# Altium project SingleChip-Rev2.PrjPcb (part 3 of 8)

## Sheet FPGA-Camera-AWR.SchDoc: =ProjectTitle
size A3; Author: Jaime I. Chait; Organization: NWES LLC; Address1: 111 SW 5th Ave, STE 3150; Address2: Portland, OR 97204; DocumentNumber: SCH-0001; Revision: 2; SheetNumber: 14; SheetTotal: 19
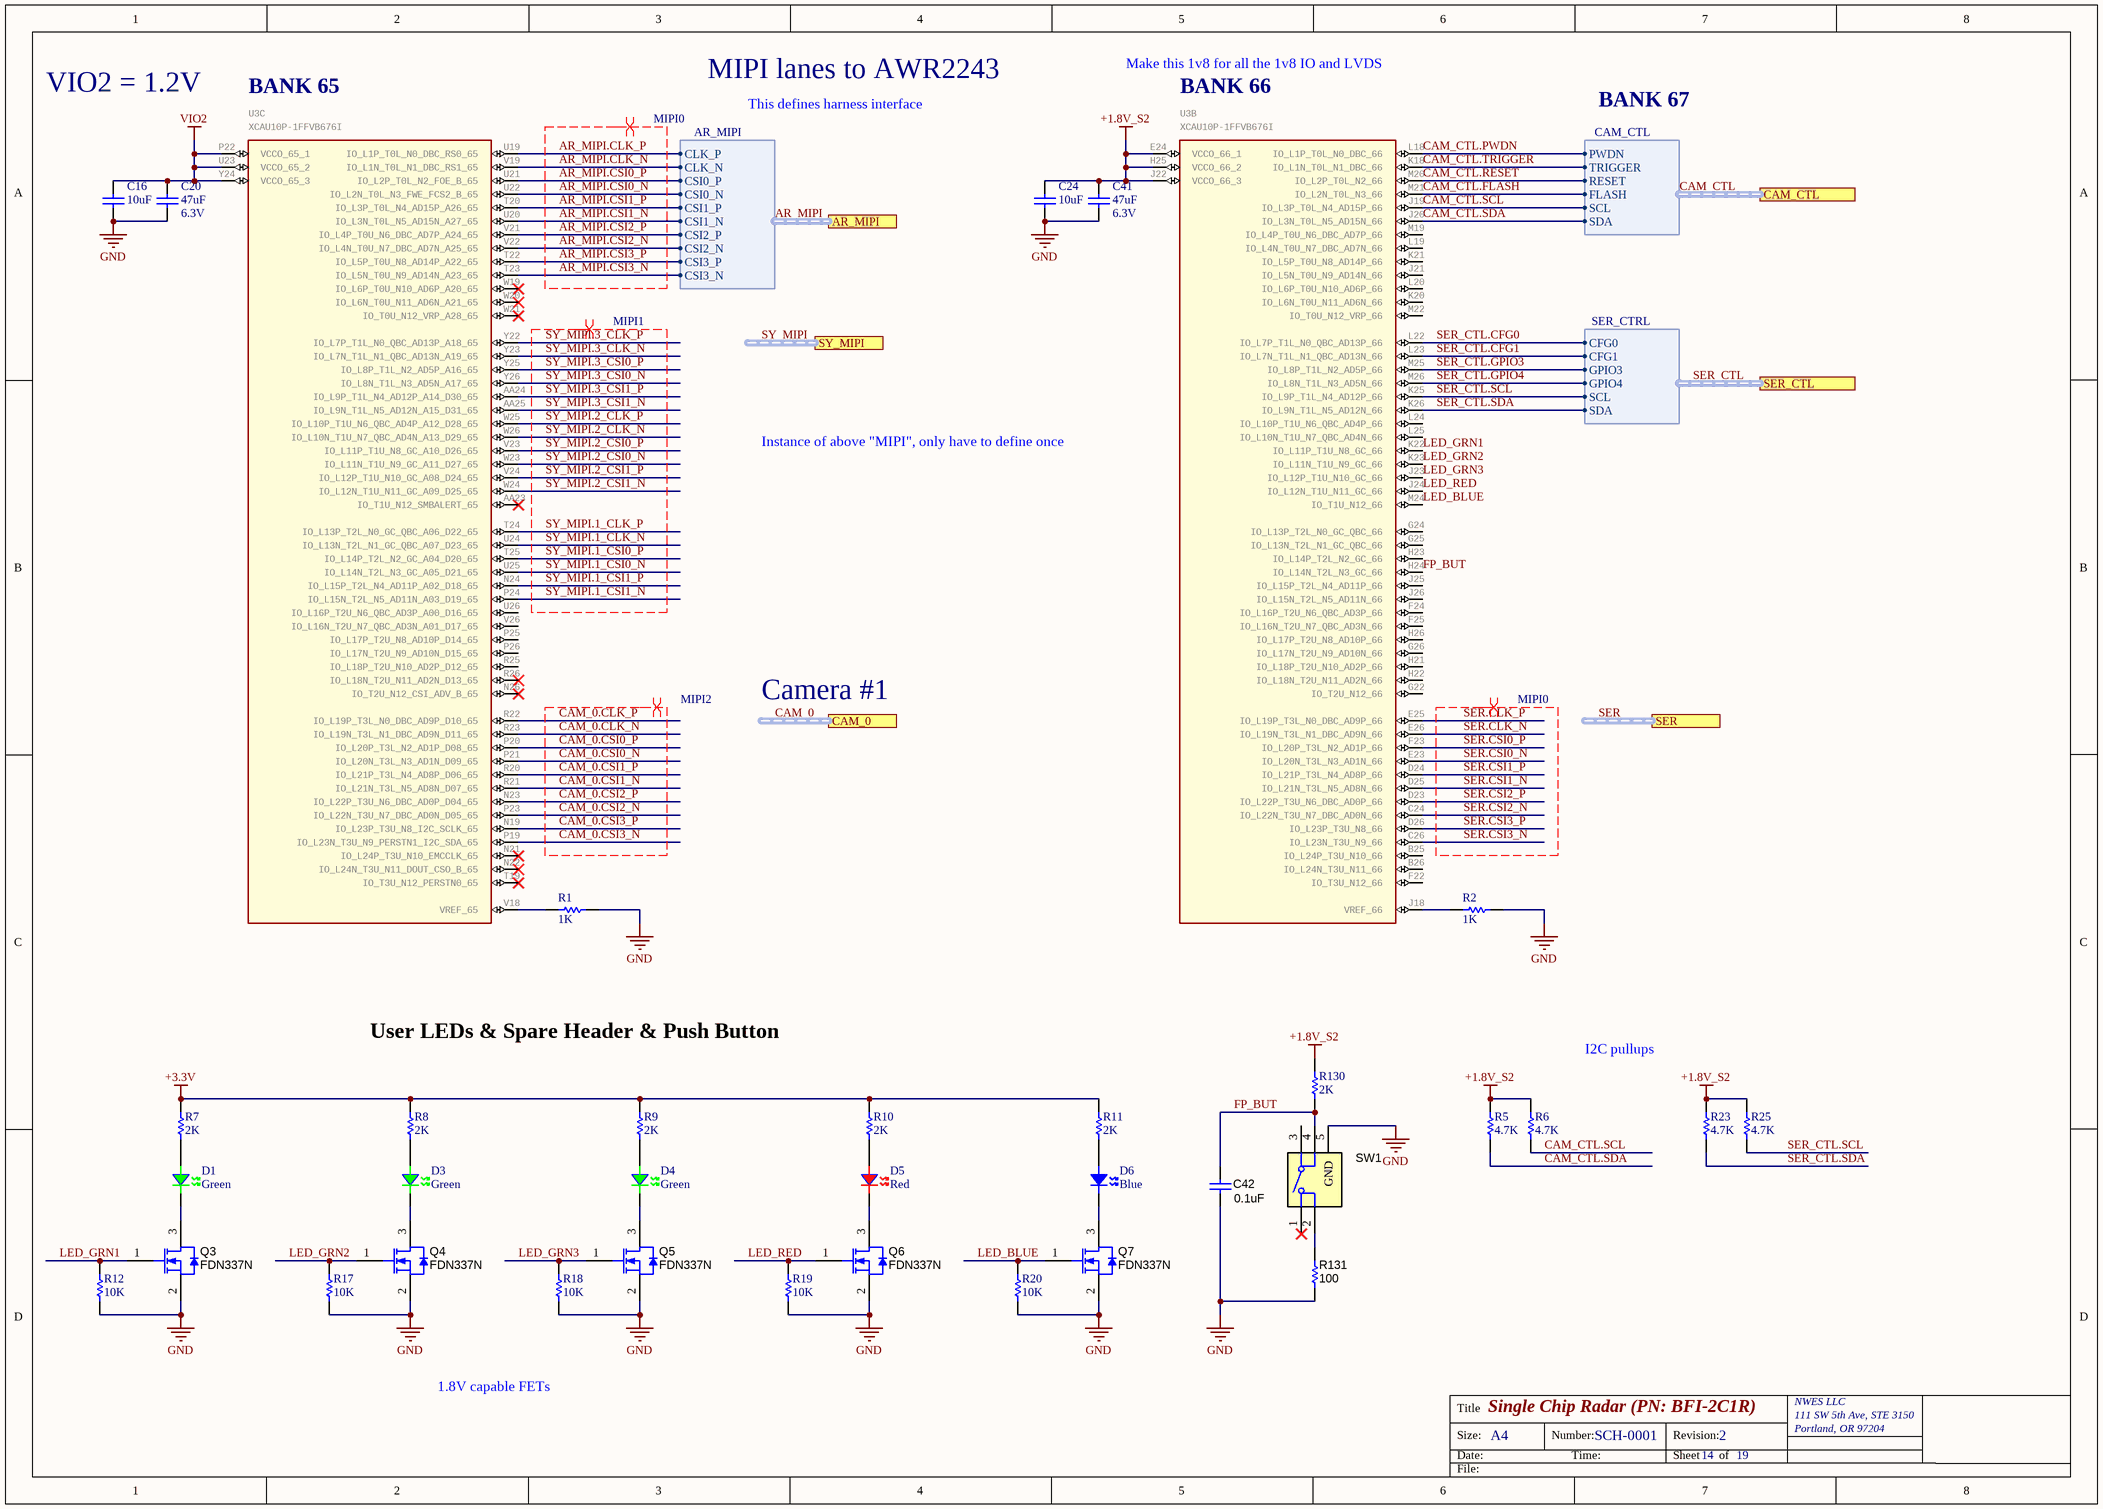
[diagram p8: FPGA-Camera-AWR.SchDoc]

### Parts
C16  10uF  [CAPC1005X90]
C20  47uF  Voltage Rating: 6.3V  [CAPC2012X145USR]
C24  10uF  [CAPC1005X90]
C41  47uF  Voltage Rating: 6.3V  [CAPC2012X145USR]
C42  ValueDisplayed: 0.1uF  [0402L]  (hidden comment: GCM155R71C104KA55D)
D1  Green  [LED_0603]
D3  Green  [LED_0603]
D4  Green  [LED_0603]
D5  Red  [LED_0603]
D6  Blue  [LED_0603]
Q3  FDN337N  [SOT-23]
Q4  FDN337N  [SOT-23]
Q5  FDN337N  [SOT-23]
Q6  FDN337N  [SOT-23]
Q7  FDN337N  [SOT-23]
R1  1K  [RESC1005X40USR]
R2  1K  [RESC1005X40USR]
R5  4.7K  [RESC1005X40USR]
R6  4.7K  [RESC1005X40USR]
R7  2K  [RESC1005X40USR]
R8  2K  [RESC1005X40USR]
R9  2K  [RESC1005X40USR]
R10  2K  [RESC1005X40USR]
R11  2K  [RESC1005X40USR]
R12  10K  [RESC1005X40USR]
R17  10K  [RESC1005X40USR]
R18  10K  [RESC1005X40USR]
R19  10K  [RESC1005X40USR]
R20  10K  [RESC1005X40USR]
R23  4.7K  [RESC1005X40USR]
R25  4.7K  [RESC1005X40USR]
R130  2K  [RESC1005X40USR]
R131  ValueDisplayed: 100  [0402L]  (hidden comment: ERJ-2GEJ101X)
SW1  KMR243GLFG  [SW_KMR243GLFG]  (value not drawn)
U3  XCAU10P-1FFVB676I  [676-FCBGA (27x27)]  (parts B,C of 16)

### Ports
AR_MIPI (harness AR_MIPI), CAM_0 (harness MIPI), CAM_CTL (harness CAM_CTL), SER (harness MIPI), SER_CTL (harness SER_CTRL), SY_MIPI (harness SY_MIPI)

### Harnesses
AR_MIPI: CLK_P, CLK_N, CSI0_P, CSI0_N, CSI1_P, CSI1_N, CSI2_P, CSI2_N, CSI3_P, CSI3_N
CAM_CTL: PWDN, TRIGGER, RESET, FLASH, SCL, SDA
SER_CTRL: CFG0, CFG1, GPIO3, GPIO4, SCL, SDA

### Nets
+1.8V_S2: C24.2 C41.1 R5.2 R6.2 R23.2 R25.2 R130.1 U3.E24(VCCO_66_1) U3.H25(VCCO_66_2) U3.J22(VCCO_66_3)
+3.3V: R7.2 R8.2 R9.2 R10.2 R11.2
GND: C16.1 C20.2 C24.1 C41.2 C42.1 Q3.2(S) Q4.2(S) Q5.2(S) Q6.2(S) Q7.2(S) R1.2 R2.2 R12.1 R17.1 R18.1 R19.1 R20.1 R131.1 SW1.5(GND)
VIO2: C16.2 C20.1 U3.P22(VCCO_65_1) U3.U23(VCCO_65_2) U3.Y24(VCCO_65_3)
AR_MIPI.CLK_N: U3.V19(IO_L1N_T0L_N1_DBC_RS1_65) ; port AR_MIPI.CLK_N
AR_MIPI.CLK_P: U3.U19(IO_L1P_T0L_N0_DBC_RS0_65) ; port AR_MIPI.CLK_P
AR_MIPI.CSI0_N: U3.U22(IO_L2N_T0L_N3_FWE_FCS2_B_65) ; port AR_MIPI.CSI0_N
AR_MIPI.CSI0_P: U3.U21(IO_L2P_T0L_N2_FOE_B_65) ; port AR_MIPI.CSI0_P
AR_MIPI.CSI1_N: U3.U20(IO_L3N_T0L_N5_AD15N_A27_65) ; port AR_MIPI.CSI1_N
AR_MIPI.CSI1_P: U3.T20(IO_L3P_T0L_N4_AD15P_A26_65) ; port AR_MIPI.CSI1_P
AR_MIPI.CSI2_N: U3.V22(IO_L4N_T0U_N7_DBC_AD7N_A25_65) ; port AR_MIPI.CSI2_N
AR_MIPI.CSI2_P: U3.V21(IO_L4P_T0U_N6_DBC_AD7P_A24_65) ; port AR_MIPI.CSI2_P
AR_MIPI.CSI3_N: U3.T23(IO_L5N_T0U_N9_AD14N_A23_65) ; port AR_MIPI.CSI3_N
AR_MIPI.CSI3_P: U3.T22(IO_L5P_T0U_N8_AD14P_A22_65) ; port AR_MIPI.CSI3_P
CAM_0.CLK_N: U3.R23(IO_L19N_T3L_N1_DBC_AD9N_D11_65)
CAM_0.CLK_P: U3.R22(IO_L19P_T3L_N0_DBC_AD9P_D10_65)
CAM_0.CSI0_N: U3.P21(IO_L20N_T3L_N3_AD1N_D09_65)
CAM_0.CSI0_P: U3.P20(IO_L20P_T3L_N2_AD1P_D08_65)
CAM_0.CSI1_N: U3.R21(IO_L21N_T3L_N5_AD8N_D07_65)
CAM_0.CSI1_P: U3.R20(IO_L21P_T3L_N4_AD8P_D06_65)
CAM_0.CSI2_N: U3.P23(IO_L22N_T3U_N7_DBC_AD0N_D05_65)
CAM_0.CSI2_P: U3.N23(IO_L22P_T3U_N6_DBC_AD0P_D04_65)
CAM_0.CSI3_N: U3.P19(IO_L23N_T3U_N9_PERSTN1_I2C_SDA_65)
CAM_0.CSI3_P: U3.N19(IO_L23P_T3U_N8_I2C_SCLK_65)
CAM_CTL.FLASH: U3.M21(IO_L2N_T0L_N3_66) ; port CAM_CTL.FLASH
CAM_CTL.PWDN: U3.L18(IO_L1P_T0L_N0_DBC_66) ; port CAM_CTL.PWDN
CAM_CTL.RESET: U3.M20(IO_L2P_T0L_N2_66) ; port CAM_CTL.RESET
CAM_CTL.SCL: R6.1 U3.J19(IO_L3P_T0L_N4_AD15P_66) ; port CAM_CTL.SCL
CAM_CTL.SDA: R5.1 U3.J20(IO_L3N_T0L_N5_AD15N_66) ; port CAM_CTL.SDA
CAM_CTL.TRIGGER: U3.K18(IO_L1N_T0L_N1_DBC_66) ; port CAM_CTL.TRIGGER
FP_BUT: C42.2 R130.2 SW1.4 U3.H24(IO_L14N_T2L_N3_GC_66)
LED_BLUE: Q7.1(G) R20.2 U3.M24(IO_T1U_N12_66)
LED_GRN1: Q3.1(G) R12.2 U3.K22(IO_L11P_T1U_N8_GC_66)
LED_GRN2: Q4.1(G) R17.2 U3.K23(IO_L11N_T1U_N9_GC_66)
LED_GRN3: Q5.1(G) R18.2 U3.J23(IO_L12P_T1U_N10_GC_66)
LED_RED: Q6.1(G) R19.2 U3.J24(IO_L12N_T1U_N11_GC_66)
SER.CLK_N: U3.E26(IO_L19N_T3L_N1_DBC_AD9N_66)
SER.CLK_P: U3.E25(IO_L19P_T3L_N0_DBC_AD9P_66)
SER.CSI0_N: U3.E23(IO_L20N_T3L_N3_AD1N_66)
SER.CSI0_P: U3.F23(IO_L20P_T3L_N2_AD1P_66)
SER.CSI1_N: U3.D25(IO_L21N_T3L_N5_AD8N_66)
SER.CSI1_P: U3.D24(IO_L21P_T3L_N4_AD8P_66)
SER.CSI2_N: U3.C24(IO_L22N_T3U_N7_DBC_AD0N_66)
SER.CSI2_P: U3.D23(IO_L22P_T3U_N6_DBC_AD0P_66)
SER.CSI3_N: U3.C26(IO_L23N_T3U_N9_66)
SER.CSI3_P: U3.D26(IO_L23P_T3U_N8_66)
SER_CTL.CFG0: U3.L22(IO_L7P_T1L_N0_QBC_AD13P_66) ; port SER_CTL.CFG0
SER_CTL.CFG1: U3.L23(IO_L7N_T1L_N1_QBC_AD13N_66) ; port SER_CTL.CFG1
SER_CTL.GPIO3: U3.M25(IO_L8P_T1L_N2_AD5P_66) ; port SER_CTL.GPIO3
SER_CTL.GPIO4: U3.M26(IO_L8N_T1L_N3_AD5N_66) ; port SER_CTL.GPIO4
SER_CTL.SCL: R25.1 U3.K25(IO_L9P_T1L_N4_AD12P_66) ; port SER_CTL.SCL
SER_CTL.SDA: R23.1 U3.K26(IO_L9N_T1L_N5_AD12N_66) ; port SER_CTL.SDA
SY_MIPI.1_CLK_N: U3.U24(IO_L13N_T2L_N1_GC_QBC_A07_D23_65)
SY_MIPI.1_CLK_P: U3.T24(IO_L13P_T2L_N0_GC_QBC_A06_D22_65)
SY_MIPI.1_CSI0_N: U3.U25(IO_L14N_T2L_N3_GC_A05_D21_65)
SY_MIPI.1_CSI0_P: U3.T25(IO_L14P_T2L_N2_GC_A04_D20_65)
SY_MIPI.1_CSI1_N: U3.P24(IO_L15N_T2L_N5_AD11N_A03_D19_65)
SY_MIPI.1_CSI1_P: U3.N24(IO_L15P_T2L_N4_AD11P_A02_D18_65)
SY_MIPI.2_CLK_N: U3.W26(IO_L10N_T1U_N7_QBC_AD4N_A13_D29_65)
SY_MIPI.2_CLK_P: U3.W25(IO_L10P_T1U_N6_QBC_AD4P_A12_D28_65)
SY_MIPI.2_CSI0_N: U3.W23(IO_L11N_T1U_N9_GC_A11_D27_65)
SY_MIPI.2_CSI0_P: U3.V23(IO_L11P_T1U_N8_GC_A10_D26_65)
SY_MIPI.2_CSI1_N: U3.W24(IO_L12N_T1U_N11_GC_A09_D25_65)
SY_MIPI.2_CSI1_P: U3.V24(IO_L12P_T1U_N10_GC_A08_D24_65)
SY_MIPI.3_CLK_N: U3.Y23(IO_L7N_T1L_N1_QBC_AD13N_A19_65)
SY_MIPI.3_CLK_P: U3.Y22(IO_L7P_T1L_N0_QBC_AD13P_A18_65)
SY_MIPI.3_CSI0_N: U3.Y26(IO_L8N_T1L_N3_AD5N_A17_65)
SY_MIPI.3_CSI0_P: U3.Y25(IO_L8P_T1L_N2_AD5P_A16_65)
SY_MIPI.3_CSI1_N: U3.AA25(IO_L9N_T1L_N5_AD12N_A15_D31_65)
SY_MIPI.3_CSI1_P: U3.AA24(IO_L9P_T1L_N4_AD12P_A14_D30_65)
NetD1_1: D1.1(A) R7.1
NetD1_2: D1.2(K) Q3.3(D)
NetD3_1: D3.1(A) R8.1
NetD3_2: D3.2(K) Q4.3(D)
NetD4_1: D4.1(A) R9.1
NetD4_2: D4.2(K) Q5.3(D)
NetD5_1: D5.1(A) R10.1
NetD5_2: D5.2(K) Q6.3(D)
NetD6_1: D6.1(A) R11.1
NetD6_2: D6.2(K) Q7.3(D)
NetR1_1: R1.1 U3.V18(VREF_65)
NetR2_1: R2.1 U3.J18(VREF_66)
NetR131_2: R131.2 SW1.2

Not connected (* = marked no-connect by the designer): SW1 1* 3; U3 AA23(IO_T1U_N12_SMBALERT_65)* B25(IO_L24P_T3U_N10_66) B26(IO_L24N_T3U_N11_66) F22(IO_T3U_N12_66) F24(IO_L16P_T2U_N6_QBC_AD3P_66) F25(IO_L16N_T2U_N7_QBC_AD3N_66) G22(IO_T2U_N12_66) G24(IO_L13P_T2L_N0_GC_QBC_66) G25(IO_L13N_T2L_N1_GC_QBC_66) G26(IO_L17N_T2U_N9_AD10N_66) H21(IO_L18P_T2U_N10_AD2P_66) H22(IO_L18N_T2U_N11_AD2N_66) H23(IO_L14P_T2L_N2_GC_66) H26(IO_L17P_T2U_N8_AD10P_66) J21(IO_L5N_T0U_N9_AD14N_66) J25(IO_L15P_T2L_N4_AD11P_66) J26(IO_L15N_T2L_N5_AD11N_66) K20(IO_L6N_T0U_N11_AD6N_66) K21(IO_L5P_T0U_N8_AD14P_66) L19(IO_L4N_T0U_N7_DBC_AD7N_66) L20(IO_L6P_T0U_N10_AD6P_66) L24(IO_L10P_T1U_N6_QBC_AD4P_66) L25(IO_L10N_T1U_N7_QBC_AD4N_66) M19(IO_L4P_T0U_N6_DBC_AD7P_66) M22(IO_T0U_N12_VRP_66) N21(IO_L24P_T3U_N10_EMCCLK_65)* N22(IO_L24N_T3U_N11_DOUT_CSO_B_65)* N26(IO_T2U_N12_CSI_ADV_B_65)* P25(IO_L17P_T2U_N8_AD10P_D14_65) P26(IO_L17N_T2U_N9_AD10N_D15_65) R25(IO_L18P_T2U_N10_AD2P_D12_65) R26(IO_L18N_T2U_N11_AD2N_D13_65)* T19(IO_T3U_N12_PERSTN0_65)* U26(IO_L16P_T2U_N6_QBC_AD3P_A00_D16_65) V26(IO_L16N_T2U_N7_QBC_AD3N_A01_D17_65) W19(IO_L6P_T0U_N10_AD6P_A20_65)* W20(IO_L6N_T0U_N11_AD6N_A21_65)* W21(IO_T0U_N12_VRP_A28_65)*

### Buses and harness runs
harness AR_MIPI = port AR_MIPI
harness CAM_0 = port CAM_0
harness CAM_CTL = port CAM_CTL
harness SER = port SER
harness SER_CTL = port SER_CTL
harness SY_MIPI = port SY_MIPI

### Layout directives
differential pair; differential pair class MIPI0: AR_MIPI.CLK_N, AR_MIPI.CLK_P, AR_MIPI.CSI0_N, AR_MIPI.CSI0_P, AR_MIPI.CSI1_N, AR_MIPI.CSI1_P, AR_MIPI.CSI2_N, AR_MIPI.CSI2_P, AR_MIPI.CSI3_N, AR_MIPI.CSI3_P, SER.CLK_N, SER.CLK_P, SER.CSI0_N, SER.CSI0_P, SER.CSI1_N, SER.CSI1_P, SER.CSI2_N, SER.CSI2_P, SER.CSI3_N, SER.CSI3_P
differential pair; differential pair class MIPI1: SY_MIPI.1_CLK_N, SY_MIPI.1_CLK_P, SY_MIPI.1_CSI0_N, SY_MIPI.1_CSI0_P, SY_MIPI.1_CSI1_N, SY_MIPI.1_CSI1_P, SY_MIPI.2_CLK_N, SY_MIPI.2_CLK_P, SY_MIPI.2_CSI0_N, SY_MIPI.2_CSI0_P, SY_MIPI.2_CSI1_N, SY_MIPI.2_CSI1_P, SY_MIPI.3_CLK_N, SY_MIPI.3_CLK_P, SY_MIPI.3_CSI0_N, SY_MIPI.3_CSI0_P, SY_MIPI.3_CSI1_N, SY_MIPI.3_CSI1_P
differential pair; differential pair class MIPI2: CAM_0.CLK_N, CAM_0.CLK_P, CAM_0.CSI0_N, CAM_0.CSI0_P, CAM_0.CSI1_N, CAM_0.CSI1_P, CAM_0.CSI2_N, CAM_0.CSI2_P, CAM_0.CSI3_N, CAM_0.CSI3_P

### Notes on the sheet
- VIO2 = 1.2V
- MIPI lanes to AWR2243
- This defines harness interface
- Make this 1v8 for all the 1v8 IO and LVDS
- BANK 67
- Instance of above "MIPI", only have to define once
- Camera #1
- User LEDs & Spare Header & Push Button
- I2C pullups
- 1.8V capable FETs
- Title
- Size:
- Date:
- A4
- Number:
- Time:
- Revision:
- Sheet
- of
- File:
- (in symbol XCAU10P-1FFVB676I, part B) BANK 66
- (in symbol XCAU10P-1FFVB676I, part C) BANK 65

### Library data of the parts
C16 C24 = CAP CER 10UF 10V X5R 0402: Manufacturer Part Number: CL05A106MP8NUB8; Manufacturer: Samsung Electro-Mechanics; Part #: E-CAP-042; Supplier Part Number 1: 1276-6830-2-ND; Package: 0402; value: 10uF; Supplier 1: Digi-Key; Height: 0.9mm; ComponentLink1Description: New link; ComponentLink1URL: *
C20 C41 = CAP CER 47UF 6.3V X5R 0805: Manufacturer: Samsung; Manufacturer Part Number: CL21A476MQYNNNE; Tolerance: 20%; Supplier 1: Digi-Key; RoHS: Yes; Category: Ceramic Capacitors; Stock 1: 1673694; Pricing 1: 1=0.29000, 10=0.20200, 50=0.13440, 100=0.11420, 500=0.08064, 1000=0.07057 (USD); Mount: Surface Mount; Case/Package: 0805; Case Code (Metric): 2012; Case Code (Imperial): 0805; Contact Plating: Tin; Min Operating Temperature: -55°C; Max Operating Temperature: 85°C; Capacitance: 47uF; Package Quantity: 1; Packaging: Tape and Reel; Dielectric: X5R; Series: CL; Construction: Flat; Length: 2mm; Width: 0.049inch; Height: 1.25mm; Thickness: 0.057inch; Depth: 1.25mm; Radiation Hardening: No; RoHS Compliant: Yes; ComponentLink1URL: https://datasheet.ciiva.com/25791/cl21a476mqynnne-25791153.pdf?src-supplier=Digi-Key; ComponentLink1Description: https://datasheet.ciiva.com/25791/cl21a476mqynnne-25791153.pdf?src-supplier=Digi-Key; ComponentLink2URL: https://datasheet.ciiva.com/26838/getdatasheetpartid-359050-26838632.pdf?src-supplier=Verical; ComponentLink2Description: https://datasheet.ciiva.com/26838/getdatasheetpartid-359050-26838632.pdf?src-supplier=Verical; Supplier Part Number 1: 1276-1852-1-ND
C42 = CMP-0006351-2: CAP, CERM, 0.1 uF, 16 V, +/- 10%, X7R, 0402; Manufacturer: MuRata; TaMin_C: -55°C; Polarized: N; SizeAreaWB_mm2: 3; Value1: Unknown; U/M: EA; Value: 0.1uF; TaMax_C: 125°C; SizeZ_mm: 0.6; SizeX_mm: 1; SizeY_mm: 0.5; Cap_Case: 0402; Value2: 16V; Cap_F: 100nF; AEC Category: Q200; Publisher: Texas Instruments; TempCo: X7R; Published: 2008-06-19; RoHS: Y; MountType: SMT; Supplier 1: Digi-Key; PackageReference: 0402; Tolerance_%: 10%; SizeArea_mm2: 0.5; CompType: Capacitor; LatestRevisionDate: 2017-03-09; PartNumber: GCM155R71C104KA55D; AEC Qualified: ?; VDC_V: 16V; ComponentLink1Description: Datasheet link; Supplier Part Number 1: 490-4759-2-ND; Technology: Ceramic; ComponentLink1URL: http://psearch.murata.com/capacitor/product/GCM155R71C104KA55%23.pdf
D1 D3 D4 = LED GREEN CLEAR SMD 0603: Manufacturer: Vishay Lite-On; Manufacturer Part Number: LTST-C191KGKT; Lens Color: Colorless; Luminous Intensity: 35mcd; Viewing Angle: 130°; Forward Voltage: 2V; Dominant Wavelength: 571nm; Test Current: 20mA; Wavelength: 574nm; Lens Style: Rectangular,Colorless; Forward Current: 30mA; Number of Elements: 1; Power Dissipation: 75mW; Reverse Voltage: 5V; Supplier 1: Digi-Key; RoHS: Yes; Category: Uncategorized; Stock 1: 3115079; Pricing 1: 1=0.26000, 10=0.14100, 100=0.06560, 500=0.06060, 1000=0.04747, 2000=0.04646 (USD); Mount: Surface Mount; Case/Package: 0603; Number of Pins: 2; Color: Green; Case Code (Metric): 1608; Case Code (Imperial): 0603; Min Operating Temperature: -55°C; Max Operating Temperature: 85°C; Packaging: Tape and Reel; Package Quantity: 1; Lens Transparency: Clear; Illumination Color: Green; Number of LEDs: 1; Power Rating: 75mW; Max Power Dissipation: 75mW; Length: 1.6mm; Width: 0.8mm; Height: 0.55mm; Depth: 0.8mm; Radiation Hardening: No; RoHS Compliant: Yes; Lead Free: Lead Free; ComponentLink1URL: https://datasheet.ciiva.com/2109/ltst-c191kgkt-2109973.pdf?src-supplier=Digi-Key; ComponentLink1Description: https://datasheet.ciiva.com/2109/ltst-c191kgkt-2109973.pdf?src-supplier=Digi-Key; Supplier Part Number 1: 160-1446-1-ND
D5 = LED RED CLEAR CHIP SMD 0603: Manufacturer: Vishay Lite-On; Manufacturer Part Number: LTST-C190KRKT; Lens Color: Colorless; Luminous Intensity: 54mcd; Forward Current: 30mA; Viewing Angle: 130°; Forward Voltage: 2.4V; Lens Style: Diffused,Colorless,Clear,Rectangular; Power Rating: 75mW; Dominant Wavelength: 631nm; Test Current: 20mA; Number of Elements: 1; Wavelength: 639nm; Reverse Voltage: 5V; Supplier 1: Digi-Key; RoHS: Yes; Category: LEDs; Stock 1: 1046012; Pricing 1: 1=0.24000, 10=0.13200, 100=0.06110, 500=0.05640, 1000=0.04418, 2000=0.04324 (USD); Mount: Surface Mount; Case/Package: 0603; Number of Pins: 2; Color: Red; Case Code (Metric): 1608; Case Code (Imperial): 0603; Min Operating Temperature: -55°C; Max Operating Temperature: 85°C; Packaging: Tape and Reel; Package Quantity: 1; Illumination Color: Red; Lens Transparency: Clear; Power Dissipation: 75mW; Number of LEDs: 1; Length: 1.6mm; Width: 0.8mm; Height: 0.8mm; Depth: 0.8mm; Radiation Hardening: No; Lead Free: Lead Free; RoHS Compliant: Yes; ComponentLink1URL: https://datasheet.ciiva.com/19482/1260381-19482354.pdf?src-supplier=Jameco; ComponentLink1Description: https://datasheet.ciiva.com/19482/1260381-19482354.pdf?src-supplier=Jameco; ComponentLink2URL: https://datasheet.ciiva.com/11774/0900766b80dc02a9-11774043.pdf?src-supplier=RSComponents; ComponentLink2Description: https://datasheet.ciiva.com/11774/0900766b80dc02a9-11774043.pdf?src-supplier=RSComponents; ComponentLink3URL: https://datasheet.ciiva.com/12403/100-ltst-c190krkt-59805-12403895.pdf?src-supplier=Mouser; ComponentLink3Description: https://datasheet.ciiva.com/12403/100-ltst-c190krkt-59805-12403895.pdf?src-supplier=Mouser; ComponentLink4URL: https://datasheet.ciiva.com/16427/ltst-c190krkt-16427674.pdf?src-supplier=Future+Electronics; ComponentLink4Description: https://datasheet.ciiva.com/16427/ltst-c190krkt-16427674.pdf?src-supplier=Future+Electronics; ComponentLink5URL: https://datasheet.ciiva.com/15117/getdatasheetpartid-57395-15117240.pdf?src-supplier=Verical; ComponentLink5Description: https://datasheet.ciiva.com/15117/getdatasheetpartid-57395-15117240.pdf?src-supplier=Verical; ComponentLink6URL: https://datasheet.ciiva.com/2109/s-110-ltst-c190krkt-2109992.pdf?src-supplier=Digi-Key; ComponentLink6Description: https://datasheet.ciiva.com/2109/s-110-ltst-c190krkt-2109992.pdf?src-supplier=Digi-Key; ComponentLink7URL: https://datasheet.ciiva.com/2109/s-110-ltst-c190krkt-2109991.pdf?src-supplier=Digi-Key; ComponentLink7Description: https://datasheet.ciiva.com/2109/s-110-ltst-c190krkt-2109991.pdf?src-supplier=Digi-Key; ComponentLink8URL: https://datasheet.ciiva.com/2109/s-110-ltst-c190krkt-2109993.pdf?src-supplier=Digi-Key; ComponentLink8Description: https://datasheet.ciiva.com/2109/s-110-ltst-c190krkt-2109993.pdf?src-supplier=Digi-Key; ComponentLink9URL: https://datasheet.ciiva.com/26937/getdatasheetpartid-631582-26937958.pdf?src-supplier=Verical; ComponentLink9Description: https://datasheet.ciiva.com/26937/getdatasheetpartid-631582-26937958.pdf?src-supplier=Verical; Supplier Part Number 1: 160-1436-1-ND
D6 = LED BLUE CLEAR CHIP SMD 0603: LED BLUE CLEAR 0603 SMD; Manufacturer: Vishay Lite-On; Manufacturer Part Number: LTST-C191TBKT; Lens Color: Colorless; Viewing Angle: 130°; Lens Style: Diffused,Colorless,Clear,Rectangular; Forward Voltage: 3.8V; Luminous Intensity: 180mcd; Dominant Wavelength: 475nm; Test Current: 20mA; Number of LEDs: 1; Wavelength: 468nm; Reverse Voltage: 5V; Max Power Dissipation: 75mW; Power Dissipation: 76mW; Supplier 1: Digi-Key; RoHS: Yes; Category: LEDs; Stock 1: 577602; Pricing 1: 1=0.33000, 10=0.26200, 100=0.11780, 500=0.10640, 1000=0.08740, 2000=0.07600 (USD); Mount: Surface Mount; Case/Package: 0603; Number of Pins: 2; Color: Blue; Case Code (Metric): 1608; Case Code (Imperial): 0603; Min Operating Temperature: -20°C; Max Operating Temperature: 80°C; Packaging: Tape and Reel; Package Quantity: 1; Lens Transparency: Clear; Forward Current: 20mA; Illumination Color: Blue; Number of Elements: 1; Length: 0.8mm; Width: 0.8mm; Height: 0.55mm; Depth: 1.6mm; Radiation Hardening: No; RoHS Compliant: Yes; Lead Free: Lead Free; ComponentLink1URL: https://datasheet.ciiva.com/2110/ltst-c191tbkt-2110256.pdf?src-supplier=Digi-Key; ComponentLink1Description: https://datasheet.ciiva.com/2110/ltst-c191tbkt-2110256.pdf?src-supplier=Digi-Key; ComponentLink2URL: https://datasheet.ciiva.com/19465/2047945-19465673.pdf?src-supplier=Jameco; ComponentLink2Description: https://datasheet.ciiva.com/19465/2047945-19465673.pdf?src-supplier=Jameco; ComponentLink3URL: https://datasheet.ciiva.com/11774/0900766b80dc02b4-11774413.pdf?src-supplier=RSComponents; ComponentLink3Description: https://datasheet.ciiva.com/11774/0900766b80dc02b4-11774413.pdf?src-supplier=RSComponents; ComponentLink4URL: https://datasheet.ciiva.com/12400/lite-on-ltst-c191tbkt-187207-12400737.pdf?src-supplier=Mouser; ComponentLink4Description: https://datasheet.ciiva.com/12400/lite-on-ltst-c191tbkt-187207-12400737.pdf?src-supplier=Mouser; ComponentLink5URL: https://datasheet.ciiva.com/16444/ltst-c191tbkt-16444756.pdf?src-supplier=Future+Electronics; ComponentLink5Description: https://datasheet.ciiva.com/16444/ltst-c191tbkt-16444756.pdf?src-supplier=Future+Electronics; ComponentLink6URL: https://datasheet.ciiva.com/15117/getdatasheetpartid-133342-15117680.pdf?src-supplier=Verical; ComponentLink6Description: https://datasheet.ciiva.com/15117/getdatasheetpartid-133342-15117680.pdf?src-supplier=Verical; ComponentLink7URL: https://datasheet.ciiva.com/2110/s-110-ltst-c191tbkt-2110257.pdf?src-supplier=Digi-Key; ComponentLink7Description: https://datasheet.ciiva.com/2110/s-110-ltst-c191tbkt-2110257.pdf?src-supplier=Digi-Key; Supplier Part Number 1: 160-1647-1-ND
Q3-Q7 = MOSFET N-CH 30V 2.2A SUPERSOT3: MOSFET N-CH 30V 2.2A SSOT3; Manufacturer: ON Semiconductor / Fairchild; Drain to Source Resistance: 65mR; Gate to Source Voltage (Vgs): 8V; Power Dissipation: 500mW; Turn-Off Delay Time: 17ns; Element Configuration: Single; Rise Time: 10ns; Turn-On Delay Time: 4ns; Input Capacitance: 300pF; Number of Elements: 1; Threshold Voltage: 700mV; Polarity: N-CHANNEL; Supplier 1: Digi-Key; Manufacturer Part Number: FDN337N; RoHS: Yes; Category: MOSFETs; Stock 1: 48367; Pricing 1: 1=0.49000, 10=0.42000, 100=0.31350, 500=0.24636, 1000=0.19037 (USD); Mount: Surface Mount; Case/Package: TO-236-3; Number of Pins: 3; Contact Plating: Tin,Matte; Weight: 0.03g; Min Operating Temperature: -55°C; Max Operating Temperature: 150°C; Continuous Drain Current (ID): 2.2A; Packaging: Tape and Reel; Drain to Source Breakdown Voltage: 30V; Max Power Dissipation: 500mW; Drain to Source Voltage (Vdss): 30V; Fall Time: 10ns; Package Quantity: 3000; Rds On Max: 65mR; Voltage Rating (DC): 30V; Current Rating: 2.2A; On-State Resistance: 65mR; Series: -; Drain-source On Resistance-Max: 65mR; Dual Supply Voltage: 30V; Termination: SMD/SMT; Nominal Vgs: 700mV; Length: 2.92mm; Width: 3.05mm; Height: 0.94mm; Lead Free: Lead Free; RoHS Compliant: Yes; Reach SVHC Compliant: Yes; ComponentLink1URL: https://datasheet.ciiva.com/14092/fdn337n-eng-datasheet-14092051.pdf?src-supplier=Distrelec; ComponentLink1Description: https://datasheet.ciiva.com/14092/fdn337n-eng-datasheet-14092051.pdf?src-supplier=Distrelec; ComponentLink2URL: https://datasheet.ciiva.com/4442/fdn337n-44286-4442315.pdf?src-supplier=Mouser; ComponentLink2Description: https://datasheet.ciiva.com/4442/fdn337n-44286-4442315.pdf?src-supplier=Mouser; ComponentLink3URL: https://datasheet.ciiva.com/19470/871017-19470804.pdf?src-supplier=Jameco; ComponentLink3Description: https://datasheet.ciiva.com/19470/871017-19470804.pdf?src-supplier=Jameco; ComponentLink4URL: https://datasheet.ciiva.com/6037/fdn337n-6037720.pdf?src-supplier=Farnell; ComponentLink4Description: https://datasheet.ciiva.com/6037/fdn337n-6037720.pdf?src-supplier=Farnell; ComponentLink5URL: https://datasheet.ciiva.com/22681/220571-22681884.pdf?src-supplier=Element14; ComponentLink5Description: https://datasheet.ciiva.com/22681/220571-22681884.pdf?src-supplier=Element14; ComponentLink6URL: https://datasheet.ciiva.com/22655/220571-22655333.pdf?src-supplier=Element14; ComponentLink6Description: https://datasheet.ciiva.com/22655/220571-22655333.pdf?src-supplier=Element14; ComponentLink7URL: https://datasheet.ciiva.com/7968/220571-7968126.pdf?src-supplier=Element14; ComponentLink7Description: https://datasheet.ciiva.com/7968/220571-7968126.pdf?src-supplier=Element14; ComponentLink8URL: https://datasheet.ciiva.com/8115/fdn337n-8115069.pdf?src-supplier=Avnet; ComponentLink8Description: https://datasheet.ciiva.com/8115/fdn337n-8115069.pdf?src-supplier=Avnet; ComponentLink9URL: https://datasheet.ciiva.com/16931/fdn337n-16931214.pdf?src-supplier=Future+Electronics; ComponentLink9Description: https://datasheet.ciiva.com/16931/fdn337n-16931214.pdf?src-supplier=Future+Electronics; ComponentLink10URL: https://datasheet.ciiva.com/8115/fdn337n-8115063.pdf?src-supplier=Avnet; ComponentLink10Description: https://datasheet.ciiva.com/8115/fdn337n-8115063.pdf?src-supplier=Avnet; ComponentLink11URL: https://datasheet.ciiva.com/931/fdn337n-931876.pdf?src-supplier=Digi-Key; ComponentLink11Description: https://datasheet.ciiva.com/931/fdn337n-931876.pdf?src-supplier=Digi-Key; ComponentLink12URL: https://datasheet.ciiva.com/931/fdn337n-931877.pdf?src-supplier=Digi-Key; ComponentLink12Description: https://datasheet.ciiva.com/931/fdn337n-931877.pdf?src-supplier=Digi-Key; ComponentLink13URL: https://datasheet.ciiva.com/931/fdn337n-931875.pdf?src-supplier=Digi-Key; ComponentLink13Description: https://datasheet.ciiva.com/931/fdn337n-931875.pdf?src-supplier=Digi-Key; Supplier Part Number 1: FDN337NCT-ND
R1 R2 = RES 1K OHM 1% 1/16W 0402: Manufacturer: YAGEO; Manufacturer Part Number: RC0402FR-071KL; Supplier Part Number 1: 311-1.00KLRCT-ND; Supplier 1: Digi-Key; Height: 0.4mm; Package: 0402; value: 1K
R5 R6 R23 R25 = RES 4.7K OHM 1% 1/16W 0402: Manufacturer: YAGEO; Manufacturer Part Number: RC0402FR-074K7L; Supplier Part Number 1: 311-4.7KLRCT-ND; Supplier 1: Digi-Key; Height: 0.4mm; Package: 0402; value: 4.7K
R7-R11 R130 = RES 2K OHM 1% 1/16W 0402: Manufacturer: YAGEO; Manufacturer Part Number: RC0402FR-072KL; Supplier Part Number 1: 311-2KLRCT-ND; Supplier 1: Digi-Key; Height: 0.4mm; Package: 0402; value: 2K
R12 R17-R20 = RES 10K OHM 1% 1/16W 0402: Manufacturer: YAGEO; Manufacturer Part Number: RC0402FR-0710KL; Supplier Part Number 1: 311-10.0KLRCT-ND; Package: 0402; Height: 0.4mm; Supplier 1: Digi-Key; value: 10K; Tolerance: ±1%
R131 = CMP-0026993-2: RES, 100, 5%, 0.1 W, AEC-Q200 Grade 0, 0402; Manufacturer: Panasonic; Power_W: 100mW; TempCo: 200 ppm/C; Value_Code: 100R; U/M: EA; Value: 100; EIA_Code: E24; SizeX_mm: 1; SizeY_mm: 0.5; SizeZ_mm: 0.6; Value2: 0.1W; CompType: Resistor; AEC Qualified: Y; AEC Grade: 0; AEC Category: Q200; Supplier Part Number 2: 65T8246; Publisher: Texas Instruments; Supplier 2: Newark; Supplier Part Number 3: 2059210; Supplier 3: Farnell; Published: 2008-06-26; RoHS: Y; Value1: 5%; MountType: SMT; Supplier 1: Digi-Key; PackageReference: 0402; Tolerance_%: 5%; Res_ohm: 100; SizeArea_mm2: 0.5; LatestRevisionDate: 2017-03-09; PartNumber: ERJ-2GEJ101X; ComponentLink1Description: Datasheet link; Supplier Part Number 1: P100JCT-ND; Technology: Thick Film; ComponentLink1URL: https://industrial.panasonic.com/cdbs/www-data/pdf/RDA0000/AOA0000C84.pdf
SW1 = CMP-0002325-1: Switch, SPST-NO, Off-Mom, 0.01 A, 32 VDC, SMD; Manufacturer: C&K Components; CurrentRating_mA: 10A; PositionCount: 1; SizeX_mm: 4.6; SizeY_mm: 2.8; SizeZ_mm: 1.9; SizeArea_mm2: 12.88; VDC_V: 32V; SizeAreaWB_mm2: 21.28; Supplier 2: Mouser; Supplier 1: Digi-Key; Supplier Part Number 1: 401-1432-2-ND; Supplier Part Number 2: 611-KMR243GLFG; PartNumber: KMR243GLFG; ComponentLink1Description: Datasheet URL; LatestRevisionDate: 2017-03-09; ComponentLink1URL: http://www.ckswitches.com/media/1479/kmr2.pdf; CompType: Switch; Publisher: Texas Instruments; Circuit: SPST-NO; RoHS: Y; Orientation: Top Actuated; SwitchFunction: Off-Mom; PackageReference: 4.2x2.8mm; MountType: SMT
U3 = XCAU10P-1FFVB676I: IC FPGA ARTIXUP 676BGA; Manufacturer: AMD Xilinx; Manufacturer Part Number: XCAU10P-1FFVB676I; Supplier Part Number 1: 122-XCAU10P-1FFVB676I-ND; Supplier 1: Supplier

## Sheet FPGA Config_Power.SchDoc: =ProjectTitle
size A3; Author: Jaime I. Chait; Organization: NWES LLC; Address1: 111 SW 5th Ave, STE 3150; Address2: Portland, OR 97204; DocumentNumber: SCH-0001; Revision: 2; SheetNumber: 13; SheetTotal: 19
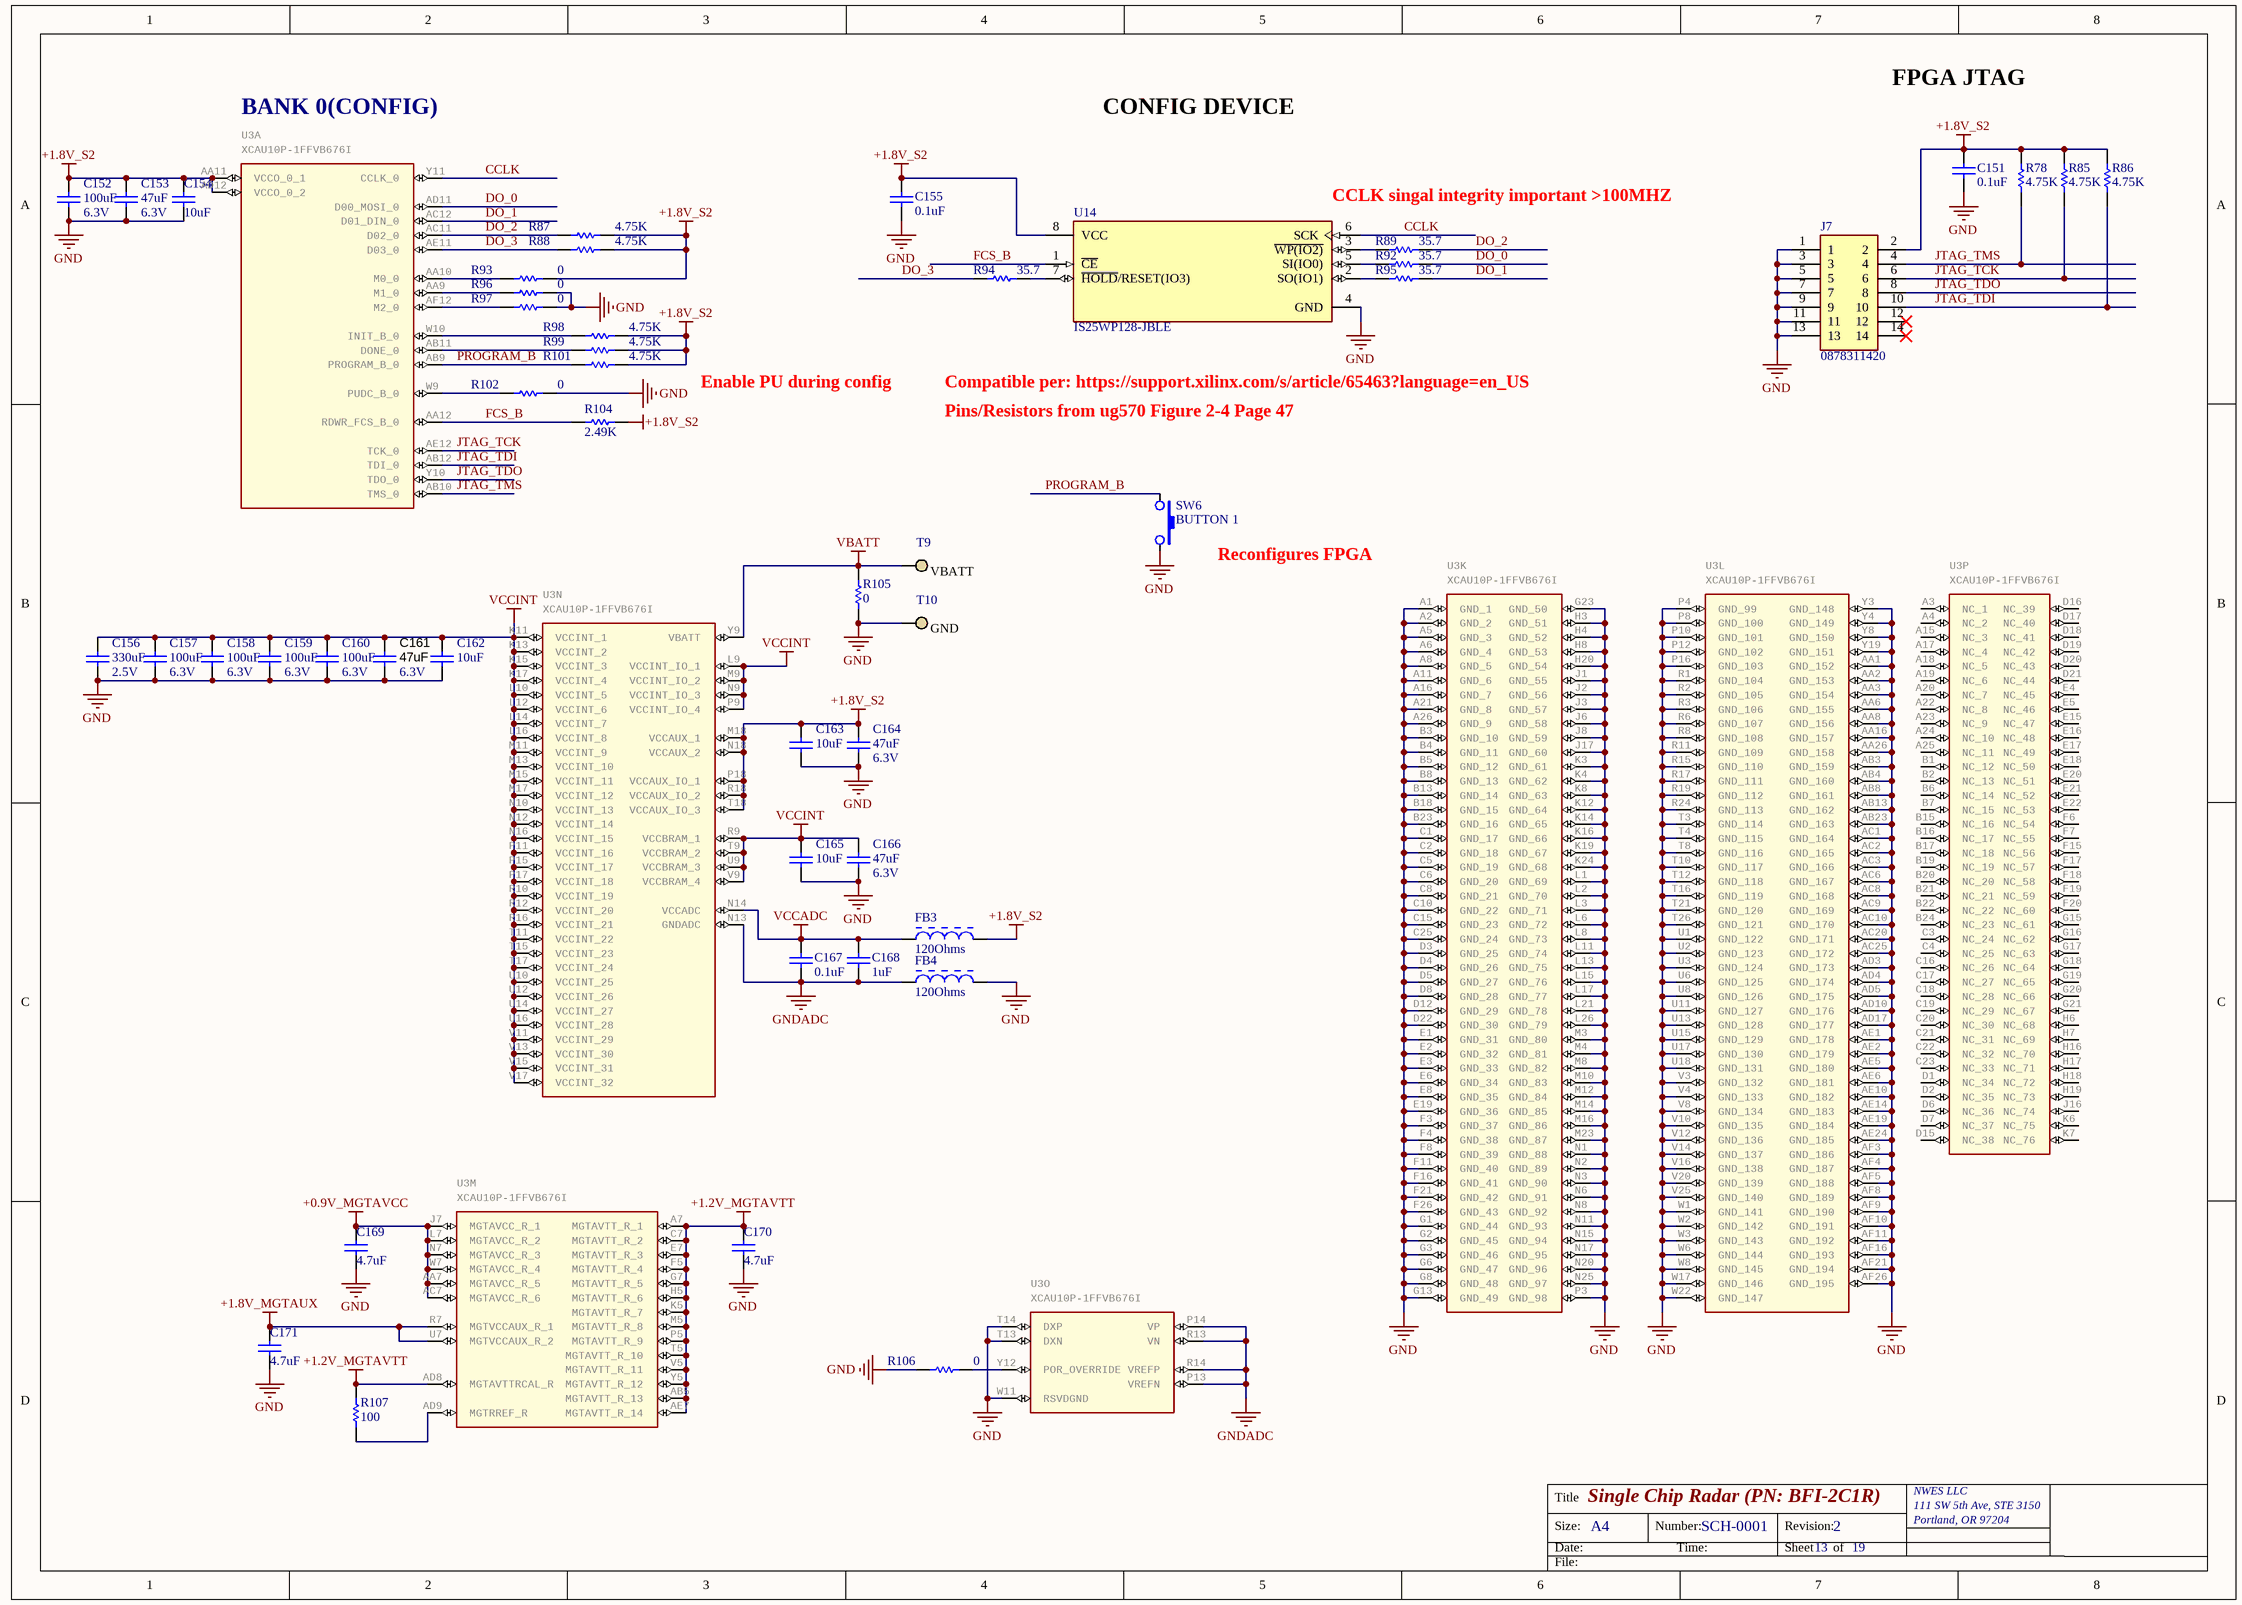
[diagram p9: FPGA Config_Power.SchDoc]

### Parts
C151  0.1uF  [CAPC1005X55USR]
C152  100uF  Voltage Rating: 6.3V  [CAPC2012X145USR]
C153  47uF  Voltage Rating: 6.3V  [CAPC2012X145USR]
C154  10uF  [CAPC1005X90]
C155  0.1uF  [CAPC1005X55USR]
C156  330uF  Voltage Rating: 2.5V  [CAPC3225X280N]
C157  100uF  Voltage Rating: 6.3V  [CAPC2012X145USR]
C158  100uF  Voltage Rating: 6.3V  [CAPC2012X145USR]
C159  100uF  Voltage Rating: 6.3V  [CAPC2012X145USR]
C160  100uF  Voltage Rating: 6.3V  [CAPC2012X145USR]
C161  47uF  Voltage Rating: 6.3V  [CAPC1608X100N]
C162  10uF  [CAPC1005X90]
C163  10uF  [CAPC1005X90]
C164  47uF  Voltage Rating: 6.3V  [CAPC2012X145USR]
C165  10uF  [CAPC1005X90]
C166  47uF  Voltage Rating: 6.3V  [CAPC2012X145USR]
C167  0.1uF  [CAPC1005X55USR]
C168  1uF  [CAPC1005X55USR]
C169  4.7uF  [CAPC1005X65USR]
C170  4.7uF  [CAPC1005X65USR]
C171  4.7uF  [CAPC1005X65USR]
FB3  120Ohms  [0402_FB]
FB4  120Ohms  [0402_FB]
J7  0878311420  [Molex_0878311420]
R78  4.75K  [RESC1005X40USR]
R85  4.75K  [RESC1005X40USR]
R86  4.75K  [RESC1005X40USR]
R87  4.75K  [RESC1005X40USR]
R88  4.75K  [RESC1005X40USR]
R89  35.7  [RESC1005X40USR]
R92  35.7  [RESC1005X40USR]
R93  0  [RESC1005X40USR]
R94  35.7  [RESC1005X40USR]
R95  35.7  [RESC1005X40USR]
R96  0  [RESC1005X40USR]
R97  0  [RESC1005X40USR]
R98  4.75K  [RESC1005X40USR]
R99  4.75K  [RESC1005X40USR]
R101  4.75K  [RESC1005X40USR]
R102  0  [RESC1005X40USR]
R104  2.49K  [RESC1005X40USR]
R105  0  [RESC1005X40USR]
R106  0  [RESC1005X40USR]
R107  100  [RESC1005X40USR]
SW6  BUTTON 1  [PTS820J25MSMTRLFS]
T9  Parameter 1: VBATT  [TP_SM_1MM]  (hidden comment: TP_S)  (no BOM)
T10  Parameter 1: GND  [TP_SM_1MM]  (hidden comment: TP_S)  (no BOM)
U3  XCAU10P-1FFVB676I  [676-FCBGA (27x27)]  (parts A,K,L,M,N,O,P of 16)
U14  IS25WP128-JBLE  [SOIC8_5.3mm_W]

### Nets
+0.9V_MGTAVCC: C169.2 U3.AA7(MGTAVCC_R_5) U3.AC7(MGTAVCC_R_6) U3.J7(MGTAVCC_R_1) U3.L7(MGTAVCC_R_2) U3.N7(MGTAVCC_R_3) U3.W7(MGTAVCC_R_4)
+1.2V_MGTAVTT: C170.2 R107.2 U3.A7(MGTAVTT_R_1) U3.AB5(MGTAVTT_R_13) U3.AD8(MGTAVTTRCAL_R) U3.AE7(MGTAVTT_R_14) U3.C7(MGTAVTT_R_2) U3.E7(MGTAVTT_R_3) U3.F5(MGTAVTT_R_4) U3.G7(MGTAVTT_R_5) U3.H5(MGTAVTT_R_6) U3.K5(MGTAVTT_R_7) U3.M5(MGTAVTT_R_8) U3.P5(MGTAVTT_R_9) U3.T5(MGTAVTT_R_10) U3.V5(MGTAVTT_R_11) U3.Y5(MGTAVTT_R_12)
+1.8V_MGTAUX: C171.2 U3.R7(MGTVCCAUX_R_1) U3.U7(MGTVCCAUX_R_2)
+1.8V_S2: C151.2 C152.1 C153.1 C154.2 C155.2 C163.2 C164.1 FB3.2 J7.2 R78.2 R85.2 R86.2 R87.1 R88.1 R93.2 R98.1 R99.1 R101.1 R104.1 U3.AA11(VCCO_0_1) U3.AD12(VCCO_0_2) U3.M18(VCCAUX_1) U3.N18(VCCAUX_2) U3.P18(VCCAUX_IO_1) U3.R18(VCCAUX_IO_2) U3.T18(VCCAUX_IO_3) U14.8(VCC)
GND: C151.1 C152.2 C153.2 C154.1 C155.1 C156.2 C157.2 C158.2 C159.2 C160.2 C161.2 C162.1 C163.1 C164.2 C165.1 C166.2 C169.1 C170.1 C171.1 FB4.2 J7.1 J7.3 J7.5 J7.7 J7.9 J7.11 J7.13 R96.2 R97.2 R102.2 R105.1 R106.1 SW6.2 T10.1 U3.A1(GND_1) U3.A2(GND_2) U3.A5(GND_3) U3.A6(GND_4) U3.A8(GND_5) U3.A11(GND_6) U3.A16(GND_7) U3.A21(GND_8) U3.A26(GND_9) U3.AA1(GND_152) U3.AA2(GND_153) U3.AA3(GND_154) U3.AA6(GND_155) U3.AA8(GND_156) U3.AA16(GND_157) U3.AA26(GND_158) U3.AB3(GND_159) U3.AB4(GND_160) U3.AB8(GND_161) U3.AB13(GND_162) U3.AB23(GND_163) U3.AC1(GND_164) U3.AC2(GND_165) U3.AC3(GND_166) U3.AC6(GND_167) U3.AC8(GND_168) U3.AC9(GND_169) U3.AC10(GND_170) U3.AC20(GND_171) U3.AC25(GND_172) U3.AD3(GND_173) U3.AD4(GND_174) U3.AD5(GND_175) U3.AD10(GND_176) U3.AD17(GND_177) U3.AE1(GND_178) U3.AE2(GND_179) U3.AE5(GND_180) U3.AE6(GND_181) U3.AE10(GND_182) U3.AE14(GND_183) U3.AE19(GND_184) U3.AE24(GND_185) U3.AF3(GND_186) U3.AF4(GND_187) U3.AF5(GND_188) U3.AF8(GND_189) U3.AF9(GND_190) U3.AF10(GND_191) U3.AF11(GND_192) U3.AF16(GND_193) U3.AF21(GND_194) U3.AF26(GND_195) U3.B3(GND_10) U3.B4(GND_11) U3.B5(GND_12) U3.B8(GND_13) U3.B13(GND_14) U3.B18(GND_15) U3.B23(GND_16) U3.C1(GND_17) U3.C2(GND_18) U3.C5(GND_19) U3.C6(GND_20) U3.C8(GND_21) U3.C10(GND_22) U3.C15(GND_23) U3.C25(GND_24) U3.D3(GND_25) U3.D4(GND_26) U3.D5(GND_27) U3.D8(GND_28) U3.D12(GND_29) U3.D22(GND_30) U3.E1(GND_31) U3.E2(GND_32) U3.E3(GND_33) U3.E6(GND_34) U3.E8(GND_35) U3.E19(GND_36) U3.F3(GND_37) U3.F4(GND_38) U3.F8(GND_39) U3.F11(GND_40) U3.F16(GND_41) U3.F21(GND_42) U3.F26(GND_43) U3.G1(GND_44) U3.G2(GND_45) U3.G3(GND_46) U3.G6(GND_47) U3.G8(GND_48) U3.G13(GND_49) U3.G23(GND_50) U3.H3(GND_51) U3.H4(GND_52) U3.H8(GND_53) U3.H20(GND_54) U3.J1(GND_55) U3.J2(GND_56) U3.J3(GND_57) U3.J6(GND_58) U3.J8(GND_59) U3.J17(GND_60) U3.K3(GND_61) U3.K4(GND_62) U3.K8(GND_63) U3.K12(GND_64) U3.K14(GND_65) U3.K16(GND_66) U3.K19(GND_67) U3.K24(GND_68) U3.L1(GND_69) U3.L2(GND_70) U3.L3(GND_71) U3.L6(GND_72) U3.L8(GND_73) U3.L11(GND_74) U3.L13(GND_75) U3.L15(GND_76) U3.L17(GND_77) U3.L21(GND_78) U3.L26(GND_79) U3.M3(GND_80) U3.M4(GND_81) U3.M8(GND_82) U3.M10(GND_83) U3.M12(GND_84) U3.M14(GND_85) U3.M16(GND_86) U3.M23(GND_87) U3.N1(GND_88) U3.N2(GND_89) U3.N3(GND_90) U3.N6(GND_91) U3.N8(GND_92) U3.N11(GND_93) U3.N15(GND_94) U3.N17(GND_95) U3.N20(GND_96) U3.N25(GND_97) U3.P3(GND_98) U3.P4(GND_99) U3.P8(GND_100) U3.P10(GND_101) U3.P12(GND_102) U3.P16(GND_103) U3.R1(GND_104) U3.R2(GND_105) U3.R3(GND_106) U3.R6(GND_107) U3.R8(GND_108) U3.R11(GND_109) U3.R15(GND_110) U3.R17(GND_111) U3.R19(GND_112) U3.R24(GND_113) U3.T3(GND_114) U3.T4(GND_115) U3.T8(GND_116) U3.T10(GND_117) U3.T12(GND_118) U3.T13(DXN) U3.T14(DXP) U3.T16(GND_119) U3.T21(GND_120) U3.T26(GND_121) U3.U1(GND_122) U3.U2(GND_123) U3.U3(GND_124) U3.U6(GND_125) U3.U8(GND_126) U3.U11(GND_127) U3.U13(GND_128) U3.U15(GND_129) U3.U17(GND_130) U3.U18(GND_131) U3.V3(GND_132) U3.V4(GND_133) U3.V8(GND_134) U3.V10(GND_135) U3.V12(GND_136) U3.V14(GND_137) U3.V16(GND_138) U3.V20(GND_139) U3.V25(GND_140) U3.W1(GND_141) U3.W2(GND_142) U3.W3(GND_143) U3.W6(GND_144) U3.W8(GND_145) U3.W11(RSVDGND) U3.W17(GND_146) U3.W22(GND_147) U3.Y3(GND_148) U3.Y4(GND_149) U3.Y8(GND_150) U3.Y19(GND_151) U14.4(GND)
GNDADC: C167.1 C168.1 FB4.1 U3.N13(GNDADC) U3.P13(VREFN) U3.P14(VP) U3.R13(VN) U3.R14(VREFP)
VBATT: R105.2 T9.1 U3.Y9(VBATT)
VCCADC: C167.2 C168.2 FB3.1 U3.N14(VCCADC)
VCCINT: C156.1 C157.1 C158.1 C159.1 C160.1 C161.1 C162.2 C165.2 C166.1 U3.K11(VCCINT_1) U3.K13(VCCINT_2) U3.K15(VCCINT_3) U3.K17(VCCINT_4) U3.L9(VCCINT_IO_1) U3.L10(VCCINT_5) U3.L12(VCCINT_6) U3.L14(VCCINT_7) U3.L16(VCCINT_8) U3.M9(VCCINT_IO_2) U3.M11(VCCINT_9) U3.M13(VCCINT_10) U3.M15(VCCINT_11) U3.M17(VCCINT_12) U3.N9(VCCINT_IO_3) U3.N10(VCCINT_13) U3.N12(VCCINT_14) U3.N16(VCCINT_15) U3.P9(VCCINT_IO_4) U3.P11(VCCINT_16) U3.P15(VCCINT_17) U3.P17(VCCINT_18) U3.R9(VCCBRAM_1) U3.R10(VCCINT_19) U3.R12(VCCINT_20) U3.R16(VCCINT_21) U3.T9(VCCBRAM_2) U3.T11(VCCINT_22) U3.T15(VCCINT_23) U3.T17(VCCINT_24) U3.U9(VCCBRAM_3) U3.U10(VCCINT_25) U3.U12(VCCINT_26) U3.U14(VCCINT_27) U3.U16(VCCINT_28) U3.V9(VCCBRAM_4) U3.V11(VCCINT_29) U3.V13(VCCINT_30) U3.V15(VCCINT_31) U3.V17(VCCINT_32)
CCLK: U3.Y11(CCLK_0) U14.6(SCK)
DO_0: R92.1 U3.AD11(D00_MOSI_0)
DO_1: R95.1 U3.AC12(D01_DIN_0)
DO_2: R87.2 R89.1 U3.AC11(D02_0)
DO_3: R88.2 R94.2 U3.AE11(D03_0)
FCS_B: R104.2 U3.AA12(RDWR_FCS_B_0) U14.1(~{CE})
JTAG_TCK: J7.6 R85.1 U3.AE12(TCK_0)
JTAG_TDI: J7.10 R86.1 U3.AB12(TDI_0)
JTAG_TDO: J7.8 U3.Y10(TDO_0)
JTAG_TMS: J7.4 R78.1 U3.AB10(TMS_0)
PROGRAM_B: R101.2 SW6.1 U3.AB9(PROGRAM_B_0)
NetR89_2: R89.2 U14.3(~{WP(IO2)})
NetR92_2: R92.2 U14.5(SI(IO0))
NetR93_1: R93.1 U3.AA10(M0_0)
NetR94_1: R94.1 U14.7(~{HOLD}/RESET(IO3))
NetR95_2: R95.2 U14.2(SO(IO1))
NetR96_1: R96.1 U3.AA9(M1_0)
NetR97_1: R97.1 U3.AF12(M2_0)
NetR98_2: R98.2 U3.W10(INIT_B_0)
NetR99_2: R99.2 U3.AB11(DONE_0)
NetR102_1: R102.1 U3.W9(PUDC_B_0)
NetR106_2: R106.2 U3.Y12(POR_OVERRIDE)
NetR107_1: R107.1 U3.AD9(MGTRREF_R)

Not connected (* = marked no-connect by the designer): J7 12* 14*; U3 A3(NC_1) A4(NC_2) A15(NC_3) A17(NC_4) A18(NC_5) A19(NC_6) A20(NC_7) A22(NC_8) A23(NC_9) A24(NC_10) A25(NC_11) B1(NC_12) B2(NC_13) B6(NC_14) B7(NC_15) B15(NC_16) B16(NC_17) B17(NC_18) B19(NC_19) B20(NC_20) B21(NC_21) B22(NC_22) B24(NC_23) C3(NC_24) C4(NC_25) C16(NC_26) C17(NC_27) C18(NC_28) C19(NC_29) C20(NC_30) C21(NC_31) C22(NC_32) C23(NC_33) D1(NC_34) D2(NC_35) D6(NC_36) D7(NC_37) D15(NC_38) D16(NC_39) D17(NC_40) D18(NC_41) D19(NC_42) D20(NC_43) D21(NC_44) E4(NC_45) E5(NC_46) E15(NC_47) E16(NC_48) E17(NC_49) E18(NC_50) E20(NC_51) E21(NC_52) E22(NC_53) F6(NC_54) F7(NC_55) F15(NC_56) F17(NC_57) F18(NC_58) F19(NC_59) F20(NC_60) G15(NC_61) G16(NC_62) G17(NC_63) G18(NC_64) G19(NC_65) G20(NC_66) G21(NC_67) H6(NC_68) H7(NC_69) H16(NC_70) H17(NC_71) H18(NC_72) H19(NC_73) J16(NC_74) K6(NC_75) K7(NC_76)

### Notes on the sheet
- CONFIG DEVICE
- FPGA JTAG
- CCLK singal integrity important >100MHZ
- Enable PU during config
- Compatible per: https://support.xilinx.com/s/article/65463?language=en_US
- Pins/Resistors from ug570 Figure 2-4 Page 47
- Reconfigures FPGA
- Title
- Size:
- Date:
- A4
- Number:
- Time:
- Revision:
- Sheet
- of
- File:
- (in symbol XCAU10P-1FFVB676I, part A) BANK 0(CONFIG)

### Library data of the parts
C151 C155 C167 = CAP CER 0.1UF 25V X5R 0402: Manufacturer Part Number: CL05A104KA5NNNC; Manufacturer: Samsung Electro-Mechanics; Supplier Part Number 1: 1276-1043-1-ND; Package: 0402; Height: 0.55mm; Supplier 1: Digi-Key; value: 0.1uF
C152 C157-C160 = CAP CER 100UF 6.3V X5R 0805: 0805 100 uF 6.3 V ±20% Tolerance X5R Multilayer Ceramic Chip Capacitor; Manufacturer: Murata; Manufacturer Part Number: GRM21BR60J107ME15L; Supplier 1: Digi-Key; RoHS: Yes; Category: Ceramic Capacitors; Stock 1: 780070; Pricing 1: 3000=0.42426, 6000=0.40911, 9000=0.39395, 15000=0.38638 (USD); Mount: Surface Mount; Case/Package: 0805; Case Code (Metric): 2012; Case Code (Imperial): 0805; Min Operating Temperature: -55°C; Max Operating Temperature: 85°C; Packaging: Cut Tape; Dielectric: X5R; Tolerance: 20%; Voltage Rating (DC): 6.3V; Capacitance: 100uF; Series: GRM; Length: 0.079inch; Width: 0.049inch; Thickness: 0.057inch; Reach SVHC Compliant: Yes; Lead Free: Lead Free; RoHS Compliant: Yes; ComponentLink1URL: http://www.farnell.com/datasheets/1957830.pdf?src-supplier=Farnell; ComponentLink1Description: http://www.farnell.com/datasheets/1957830.pdf?src-supplier=Farnell; ComponentLink2URL: http://www.farnell.com/datasheets/1957830.pdf?src-supplier=Element14; ComponentLink2Description: http://www.farnell.com/datasheets/1957830.pdf?src-supplier=Element14; ComponentLink3URL: https://search.murata.co.jp/Ceramy/image/img/A01X/G101/ENG/GRM21BR60J107ME15-01.pdf?src-supplier=Digi-Key; ComponentLink3Description: https://search.murata.co.jp/Ceramy/image/img/A01X/G101/ENG/GRM21BR60J107ME15-01.pdf?src-supplier=Digi-Key; ComponentLink4URL: http://www.farnell.com/datasheets/1957830.pdf?src-supplier=Newark; ComponentLink4Description: http://www.farnell.com/datasheets/1957830.pdf?src-supplier=Newark; Supplier Part Number 1: 490-13981-2-ND
C153 C164 C166 = CAP CER 47UF 6.3V X5R 0805: as C20 on sheet FPGA-Camera-AWR; Supplier 1: Digi-Key; RoHS: Yes; Category: Ceramic Capacitors; Stock 1: 1673694; Pricing 1: 1=0.29000, 10=0.20200, 50=0.13440, 100=0.11420, 500=0.08064, 1000=0.07057 (USD); Mount: Surface Mount; Case/Package: 0805; Case Code (Metric): 2012; Case Code (Imperial): 0805; Contact Plating: Tin; Min Operating Temperature: -55°C; Max Operating Temperature: 85°C; Capacitance: 47uF; Package Quantity: 1; Packaging: Tape and Reel; Dielectric: X5R; Series: CL; Construction: Flat; Length: 2mm; Width: 0.049inch; Height: 1.25mm; Thickness: 0.057inch; Depth: 1.25mm; Radiation Hardening: No; RoHS Compliant: Yes; ComponentLink1URL: https://datasheet.ciiva.com/25791/cl21a476mqynnne-25791153.pdf?src-supplier=Digi-Key; ComponentLink1Description: https://datasheet.ciiva.com/25791/cl21a476mqynnne-25791153.pdf?src-supplier=Digi-Key; ComponentLink2URL: https://datasheet.ciiva.com/26838/getdatasheetpartid-359050-26838632.pdf?src-supplier=Verical; ComponentLink2Description: https://datasheet.ciiva.com/26838/getdatasheetpartid-359050-26838632.pdf?src-supplier=Verical; Supplier Part Number 1: 1276-1852-1-ND
C154 C162 C163 C165 = CAP CER 10UF 10V X5R 0402: as C16 on sheet FPGA-Camera-AWR; Supplier Part Number 1: 1276-6830-2-ND; Package: 0402; value: 10uF; Supplier 1: Digi-Key; Height: 0.9mm; ComponentLink1Description: New link; ComponentLink1URL: *
C156 = CAP CER 330UF 2.5V X6S 1210: 1210 2.5V X6S 330uF 20% multilayer ceramic capacitor; Manufacturer: Murata; Manufacturer Part Number: GRM32EC80E337ME05L; Supplier 1: Digi-Key; RoHS: Yes; Category: Ceramic Capacitors; Stock 1: 66804; Pricing 1: 1=1.88000, 10=1.48300, 50=1.28540, 100=1.11240, 500=0.84050 (USD); Mount: Surface Mount; Case/Package: 1210; Case Code (Metric): 3225; Case Code (Imperial): 1210; Min Operating Temperature: -55°C; Max Operating Temperature: 105°C; Packaging: Tape and Reel; Capacitance: 330uF; Tolerance: 20%; Voltage Rating (DC): 2.5V; Dielectric: X6S; Length: 0.126inch; Width: 0.098inch; Thickness: 0.11inch; RoHS Compliant: Yes; ComponentLink1URL: http://www.farnell.com/datasheets/2867880.pdf?src-supplier=Farnell; ComponentLink1Description: http://www.farnell.com/datasheets/2867880.pdf?src-supplier=Farnell; ComponentLink2URL: http://search.murata.co.jp/Ceramy/image/img/A01X/partnumbering_e_01.pdf?src-supplier=Digi-Key; ComponentLink2Description: http://search.murata.co.jp/Ceramy/image/img/A01X/partnumbering_e_01.pdf?src-supplier=Digi-Key; ComponentLink3URL: http://search.murata.co.jp/Ceramy/image/img/A01X/G101/ENG/GRM32EC80E337ME05-01.pdf?src-supplier=Digi-Key; ComponentLink3Description: http://search.murata.co.jp/Ceramy/image/img/A01X/G101/ENG/GRM32EC80E337ME05-01.pdf?src-supplier=Digi-Key; ComponentLink4URL: http://www.farnell.com/datasheets/2165382.pdf?src-supplier=Newark; ComponentLink4Description: http://www.farnell.com/datasheets/2165382.pdf?src-supplier=Newark; Supplier Part Number 1: 490-13972-1-ND
C161 = CAP CER 47UF 6.3V X5R 0603: 0603 6.3 V 47 uF ±20% Tolerance X5R SMT Multilayer Ceramic Chp Capacitor; Manufacturer: Murata; Manufacturer Part Number: GRM188R60J476ME15D; Supplier 1: Digi-Key; RoHS: Yes; Category: Ceramic Capacitors; Stock 1: 865472; Pricing 1: 1=0.45000, 10=0.31900, 50=0.24120, 100=0.21000, 500=0.15556, 1000=0.13223 (USD); Mount: Surface Mount; Case/Package: 0603; Case Code (Metric): 1608; Case Code (Imperial): 0603; Min Operating Temperature: -55°C; Max Operating Temperature: 85°C; Capacitance: 47uF; Tolerance: 20%; Packaging: Tape and Reel; Dielectric: X5R; Length: 0.063inch; Width: 0.031inch; Thickness: 0.039inch; RoHS Compliant: Yes; ComponentLink1URL: http://search.murata.co.jp/Ceramy/image/img/A01X/G101/ENG/GRM188R60J476ME15-01.pdf?src-supplier=Digi-Key; ComponentLink1Description: http://search.murata.co.jp/Ceramy/image/img/A01X/G101/ENG/GRM188R60J476ME15-01.pdf?src-supplier=Digi-Key; ComponentLink2URL: https://www.murata.com/~/media/webrenewal/support/library/catalog/products/capacitor/mlcc/c02e.ashx?la=en-us&src-supplier=Digi-Key; ComponentLink2Description: https://www.murata.com/~/media/webrenewal/support/library/catalog/products/capacitor/mlcc/c02e.ashx?la=en-us&src-supplier=Digi-Key; Supplier Part Number 1: 490-13247-1-ND; Voltage Rating (DC): 6.3V
C168 = CAP CER 1UF 25V X5R 0402: Manufacturer Part Number: GRM155R61E105MA12D; Manufacturer: Murata Electronics; Part #: E-CAP-042; Supplier Part Number 1: 490-10018-1-ND; Package: 0402; value: 1uF; Supplier 1: Digi-Key; Height: 0.55mm; ComponentLink1Description: New link; ComponentLink1URL: *
C169-C171 = CAP CER 4.7UF 10V X5R 0402: Manufacturer Part Number: C1005X5R1A475M050BC; Manufacturer: TDK Corporation; Package: 0402; Supplier Part Number 1: 445-8023-1-ND; Value: 4.7uF; Supplier 1: Digi-Key
FB3 FB4 = FERRITE BEAD 120 OHM 0402 1LN: Manufacturer Part Number: BLM15AG121SN1D; Manufacturer: Murata Electronics; Supplier Part Number 1: 490-1005-2-ND; Package: 0402; Value: 120Ohms; Supplier 1: Digi-Key; Height: 0.55mm; ComponentLink1Description: New link; ComponentLink1URL: *
J7 = HEADER VERT 2X7 2MM: 2.00mm Pitch Milli-Grid Header Vertical Through Hole Shrouded 14 Circuits 0.38; Manufacturer: Molex; Manufacturer Part Number: 87831-1420; Current Rating: 2A; Voltage Rating: 125V; Number of Positions: 14; Gender: Male; Insulation Resistance: 1GR; Shrouded: Yes (With); Pitch: 2mm; Glow Wire Compliant: Non-compliant; Supplier 1: Digi-Key; RoHS: Yes; Category: Headers and Wire Housings; Stock 1: 29512; Pricing 1: 1=2.58000, 10=2.19800, 100=1.81590, 1000=1.43364, 5000=1.27116 (USD); Mount: Through Hole; Contact Plating: Gold; Contact Material: Brass,Bronze,Gold; Color: Black; Housing Color: Black; Housing Material: Thermoplastic; Min Operating Temperature: -55°C; Max Operating Temperature: 105°C; Number of Rows: 2; Package Quantity: 3200; Packaging: Rail/Tube; Termination: Solder; Number of Contacts: 14; Orientation: Vertical; Number of Circuits: 14; Voltage Rating (DC): 125V; Series: Milli-Grid; Lead Pitch: 2mm; Radiation Hardening: No; Reach SVHC Compliant: Yes; Lead Free: Lead Free; Flammability Rating: UL94 V-0; RoHS Compliant: Yes; ComponentLink1URL: https://datasheet.ciiva.com/27096/1934585-27096088.pdf?src-supplier=Jameco; ComponentLink1Description: https://datasheet.ciiva.com/27096/1934585-27096088.pdf?src-supplier=Jameco; ComponentLink2URL: https://datasheet.ciiva.com/30081/113380878311420-pcb-headers-30081880.pdf?src-supplier=Onlinecomponents.com; ComponentLink2Description: https://datasheet.ciiva.com/30081/113380878311420-pcb-headers-30081880.pdf?src-supplier=Onlinecomponents.com; ComponentLink3URL: https://datasheet.ciiva.com/5150/0878311420-pcb-headers-176448-5150987.pdf?src-supplier=Mouser; ComponentLink3Description: https://datasheet.ciiva.com/5150/0878311420-pcb-headers-176448-5150987.pdf?src-supplier=Mouser; ComponentLink4URL: https://datasheet.ciiva.com/11746/0900766b80d68c18-11746337.pdf?src-supplier=RSComponents; ComponentLink4Description: https://datasheet.ciiva.com/11746/0900766b80d68c18-11746337.pdf?src-supplier=RSComponents; ComponentLink5URL: https://datasheet.ciiva.com/7814/1785393-7814919.pdf?src-supplier=Element14; ComponentLink5Description: https://datasheet.ciiva.com/7814/1785393-7814919.pdf?src-supplier=Element14; Supplier Part Number 1: WM17469-ND
R78 R85-R88 R98 R99 R101 = RES 4.75K OHM 1% 1/16W 0402: Manufacturer: YAGEO; Manufacturer Part Number: RC0402FR-074K75L; Supplier Part Number 1: 311-4.75KLCT-ND; Supplier 1: Digi-Key; Height: 0.4mm; Package: 0402; value: 4.75K
R89 R92 R94 R95 = RES 35.7 OHM 1% 1/16W 0402: Manufacturer: YAGEO; Manufacturer Part Number: RC0402FR-0735R7L; Supplier Part Number 1: YAG3131CT-ND; Supplier 1: Digi-Key; Height: 0.4mm; Package: 0402; value: 35.7
R93 R96 R97 R102 R105 R106 = RES 0 OHM JUMPER 1/16W 0402: Manufacturer: Yageo; Manufacturer Part Number: RC0402JR-070RL; Supplier Part Number 1: 311-0.0JRTR-ND; Package: 0402; Height: 0.4mm; Supplier 1: Digi-Key; value: 0
R104 = RES 2.49K OHM 1% 1/16W 0402: Manufacturer: YAGEO; Manufacturer Part Number: RC0402FR-072K49L; Supplier Part Number 1: 311-2.49KLRCT-ND; Supplier 1: Digi-Key; Height: 0.4mm; Package: 0402; value: 2.49K
R107 = RES 100 OHM 1% 1/16W 0402: Manufacturer: YAGEO; Manufacturer Part Number: RC0402FR-07100RL; Supplier Part Number 1: 311-100LRCT-ND; Supplier 1: Digi-Key; Height: 0.4mm; Package: 0402; value: 100
SW6 = SW_PTS820: C&K Series-PTS Tactile Switch PTS820 J25K SMTR LFS; Manufacturer: ITT C&K; Mechanical Life: 100000Cycles; Operating Force: 250gf; Throw Configuration: SPST; Current Rating: 50mA; Voltage Rating (DC): 12V; Illumination Type: Non-Illuminated; Switch Travel: 0.2mm; Switch Function: Off-Mom; Actuator Type: Standard; Supplier 1: Digi-Key; Manufacturer Part Number: PTS820J25KSMTRLFS; RoHS: Yes; Category: Tactile Switches; Stock 1: 37051; Pricing 1: 1=0.57000, 10=0.54600, 25=0.52560, 100=0.45500, 250=0.41456, 500=0.38424, 1000=0.34379 (USD); Mount: Surface Mount; Color: Black; Contact Plating: Silver; Min Operating Temperature: -40°C; Max Operating Temperature: 85°C; Packaging: Tape and Reel; Package Quantity: 2300; RoHS Compliant: Yes; ComponentLink1URL: https://datasheet.ciiva.com/24079/pts820-4mar13-248116-24079446.pdf?src-supplier=Mouser; ComponentLink1Description: https://datasheet.ciiva.com/24079/pts820-4mar13-248116-24079446.pdf?src-supplier=Mouser; Supplier Part Number 1: CKN10897CT-ND
T9 T10 = Test point PAD: test point
U3 = XCAU10P-1FFVB676I: as U3 on sheet FPGA-Camera-AWR; Manufacturer Part Number: XCAU10P-1FFVB676I; Supplier Part Number 1: 122-XCAU10P-1FFVB676I-ND; Supplier 1: Supplier
U14 = IS25WP128-JBLE: 128M QPI/QSPI, 8- SOP 208M , R HS, ET; Manufacturer: ISSI; Frequency: 133MHz; Address Bus Width: 24b; Density: 128Mb; Interface: SPI,Serial; Operating Supply Voltage: 1.8V; Memory Type: FLASH,NOR; Page Size: 256B; Max Operating Temperature: 105°C; Packaging: Rail/Tube; Min Operating Temperature: -40°C; Number of Pins: 8; RoHS Compliant: Yes; Case/Package: SOIC; Supplier 1: Digi-Key; Manufacturer Part Number: IS25WP128-JBLE; RoHS: Yes; Category: Flash; Stock 1: 30572; Pricing 1: 1=2.63000, 10=2.36700, 25=2.33080, 50=2.32460, 100=2.07720, 250=2.00892, 500=2.00160, 1000=1.86385, 5000=1.72500 (USD); ComponentLink1URL: http://www.mouser.com/ds/2/198/IS25WP032-064-128-737458.pdf?src-supplier=Mouser; ComponentLink1Description: http://www.mouser.com/ds/2/198/IS25WP032-064-128-737458.pdf?src-supplier=Mouser; ComponentLink2URL: http://www.issi.com/WW/pdf/IS25WP032-064-128.pdf?src-supplier=Avnet; ComponentLink2Description: http://www.issi.com/WW/pdf/IS25WP032-064-128.pdf?src-supplier=Avnet; ComponentLink3URL: http://www.issi.com/WW/pdf/IS25WP032-064-128.pdf?src-supplier=Digi-Key; ComponentLink3Description: http://www.issi.com/WW/pdf/IS25WP032-064-128.pdf?src-supplier=Digi-Key; Supplier Part Number 1: 706-1443-ND